# Altium schematic sheet Cell_121_sheet_1.SchDoc: Агат. Модуль дисплейного контроллера
size 420 x 297 mm; ApprovedBy: v0.4; CheckedBy: emuverse.ru; Author: Panther; CompanyName: agatcomp.ru; DocumentNumber: Фг3.089.121 Э3; Revision: v0.4; SheetNumber: 1; SheetTotal: 4; DocumentType: Схема электрическая принципиальная; Title2str: (Ячейка 121); Letter1Column: T
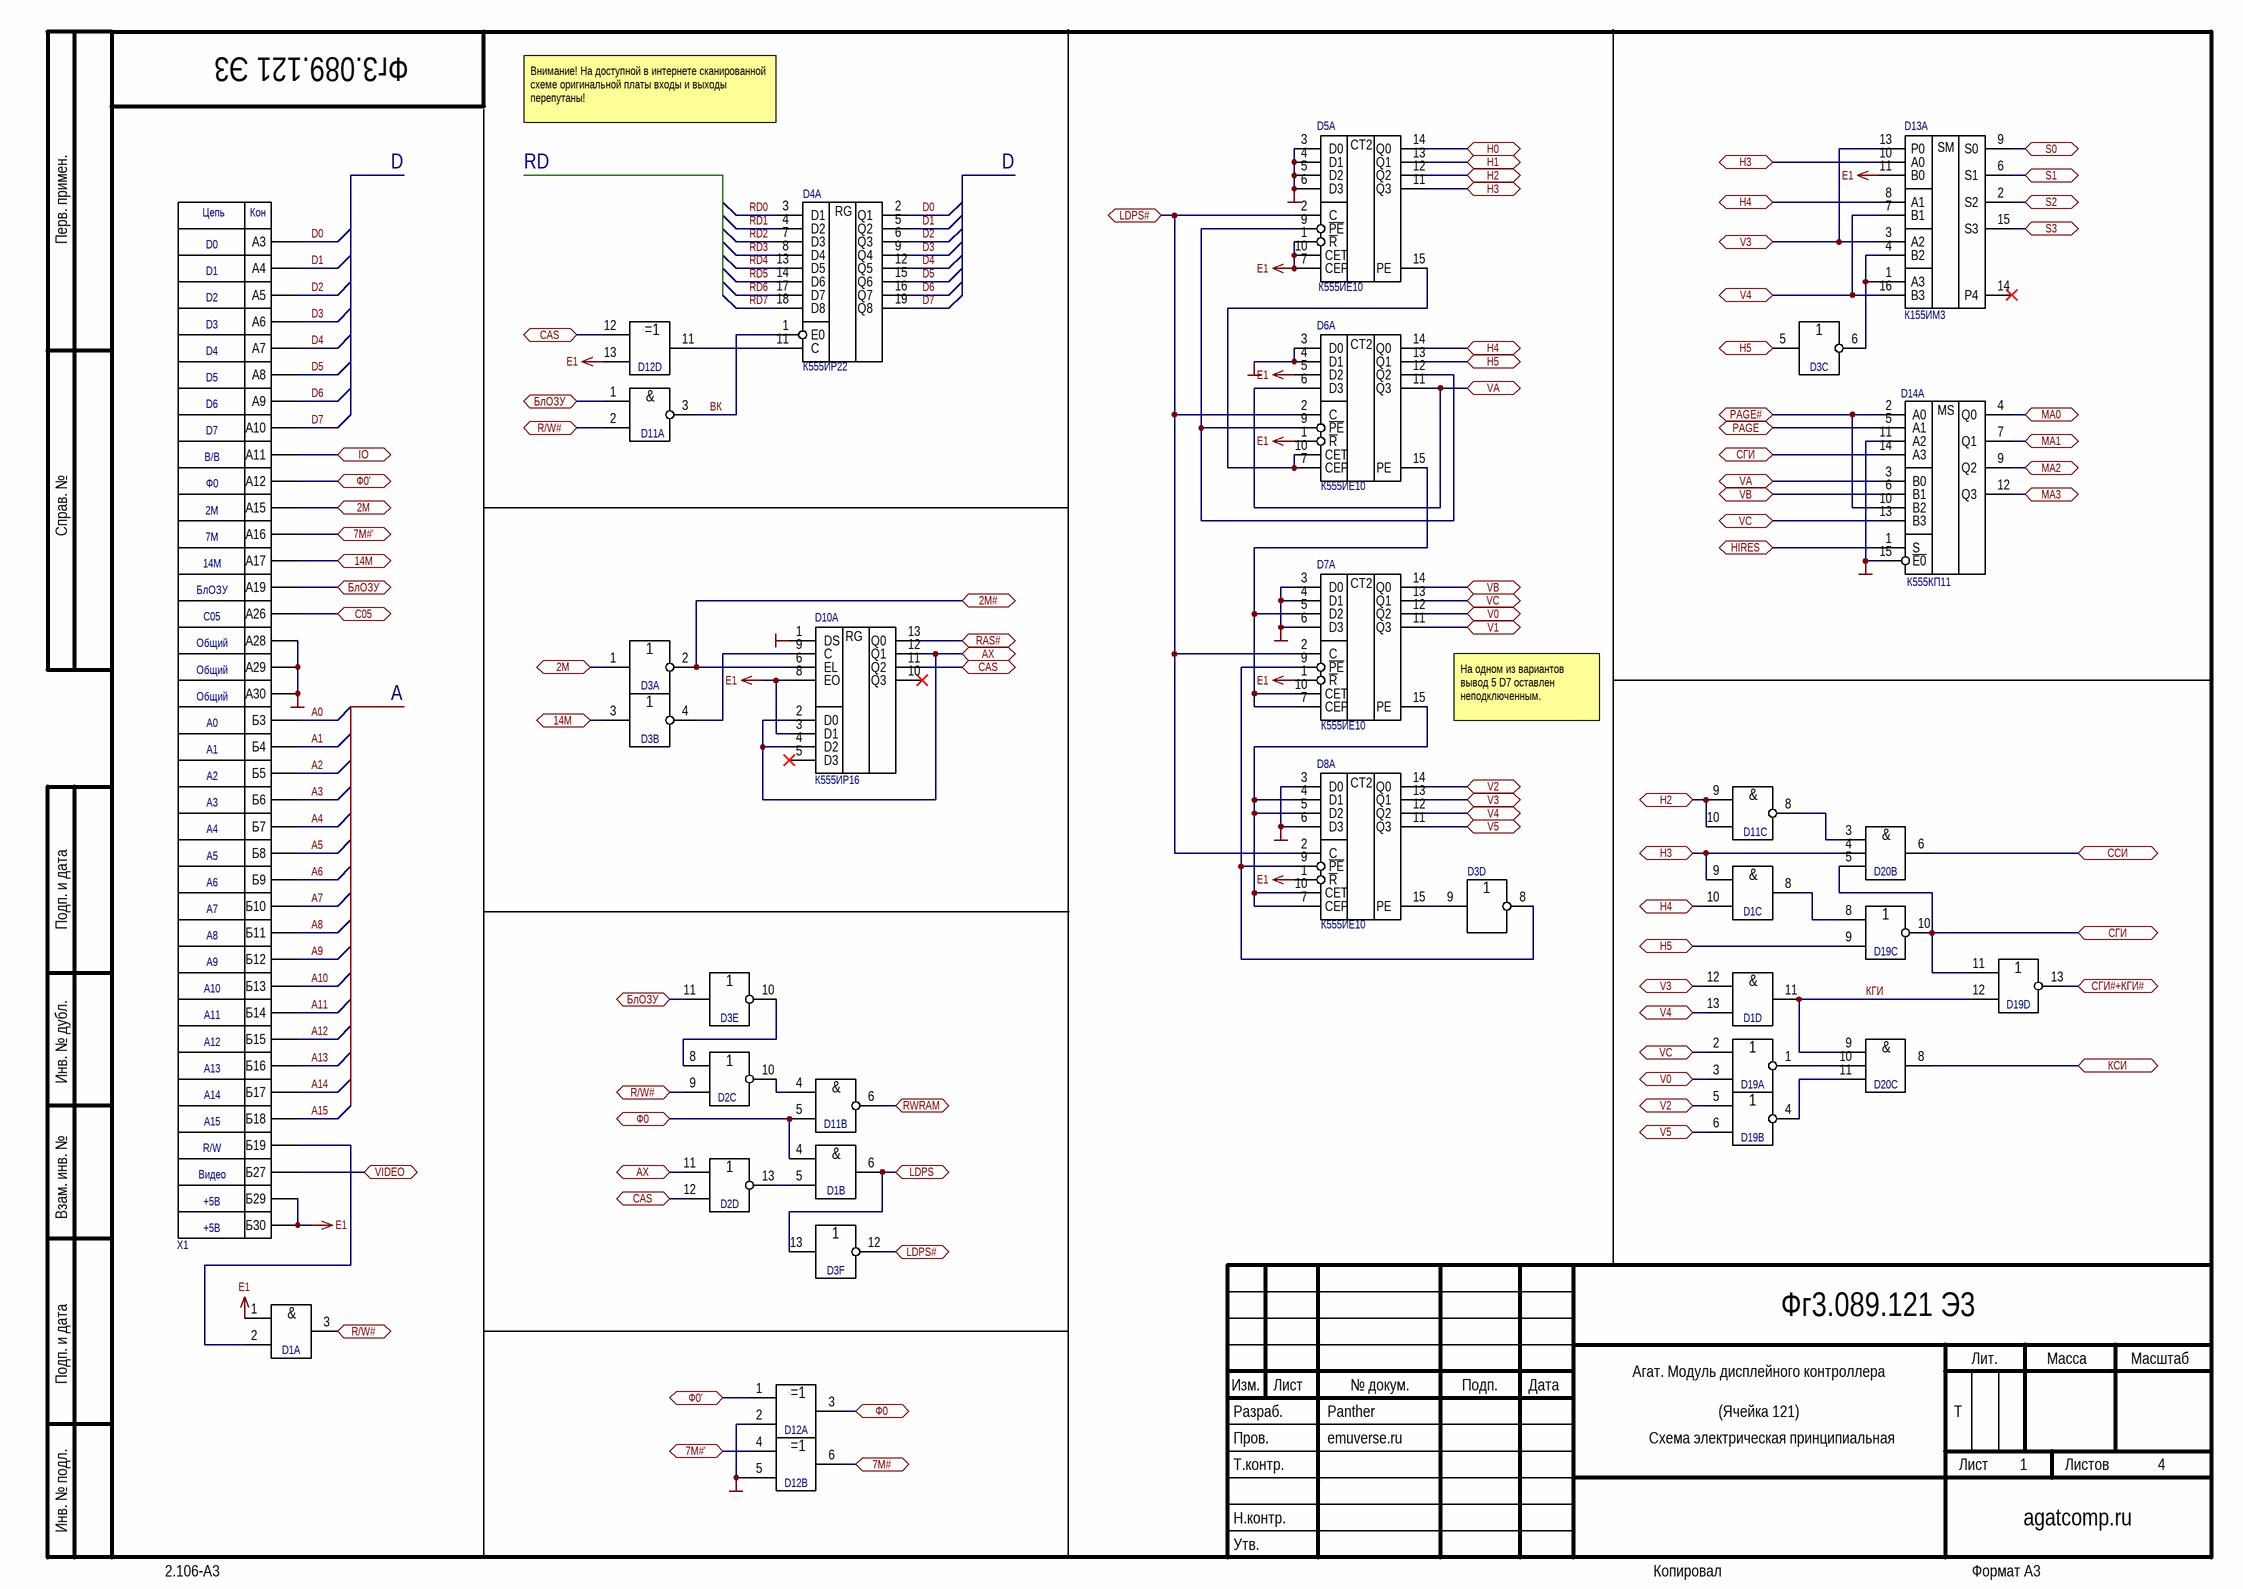
[diagram p0: Cell_121_sheet_1.SchDoc]

## Parts
D1  К555ЛИ1  [201.14]  (value not drawn)  (parts A,B,C,D of 5)
D2  К555ЛЕ1  [201.14]  (value not drawn)  (parts C,D of 5)
D3  К555ЛН1  [201.14]  (value not drawn)  (parts A,B,C,D,E,F of 7)
D4  К555ИР22  [201.20]  (part A of 2)
D5  К555ИЕ10  [201.16]  (part A of 2)
D6  К555ИЕ10  [201.16]  (part A of 2)
D7  К555ИЕ10  [201.16]  (part A of 2)
D8  К555ИЕ10  [201.16]  (part A of 2)
D10  К555ИР16  [201.14]  (part A of 2)
D11  К555ЛА3  [201.14]  (value not drawn)  (parts A,B,C of 5)
D12  К555ЛП5  [201.14]  (value not drawn)  (parts A,B,D of 5)
D13  К155ИМ3  [201.16]  (part A of 2)
D14  К555КП11  [201.16]  (part A of 2)
D19  К555ЛЕ1  [201.14]  (value not drawn)  (parts A,B,C,D of 5)
D20  К555ЛИ3  [201.14]  (value not drawn)  (parts B,C of 4)
X1  Agat-Ext  [AGAT_EXT]  (value not drawn)  (no BOM)

## Ports
2M (bidir, see Cell_121_sheet_1[1B]), 2M# (bidir, see Cell_121_sheet_3[2D]), 7M# (bidir, see Cell_121_sheet_3[1B], Cell_121_sheet_3[1C], Cell_121_sheet_3[2B], Cell_121_sheet_3[3B]), 7M#' (bidir, see Cell_121_sheet_1[1B]), 7M#' (bidir, see Cell_121_sheet_1[2D]), 14M (bidir, see Cell_121_sheet_1[1B]), AX (bidir, see Cell_121_sheet_1[2B], Cell_121_sheet_2[2C]), AX (bidir, see Cell_121_sheet_1[2C], Cell_121_sheet_2[2C]), C05 (bidir, see Cell_121_sheet_3[2D]), CAS (bidir, see Cell_121_sheet_1[1A], Cell_121_sheet_1[2B], Cell_121_sheet_2[3B], Cell_121_sheet_2[3C], Cell_121_sheet_2[3D]), CAS (bidir, see Cell_121_sheet_1[1A], Cell_121_sheet_1[2D], Cell_121_sheet_2[3B], Cell_121_sheet_2[3C], Cell_121_sheet_2[3D]), CAS (bidir, see Cell_121_sheet_1[2B], Cell_121_sheet_1[2D], Cell_121_sheet_2[3B], Cell_121_sheet_2[3C], Cell_121_sheet_2[3D]), H0 (bidir, see Cell_121_sheet_2[2B]), H1 (bidir, see Cell_121_sheet_2[2C]), H2 (bidir, see Cell_121_sheet_1[3A], Cell_121_sheet_2[2B]), H2 (bidir, see Cell_121_sheet_1[3C], Cell_121_sheet_2[2B]), H3 (bidir, see Cell_121_sheet_1[3A], Cell_121_sheet_1[3C]), H3 (bidir, see Cell_121_sheet_1[3A], Cell_121_sheet_1[4A]), H3 (bidir, see Cell_121_sheet_1[3C], Cell_121_sheet_1[4A]), H4 (bidir, see Cell_121_sheet_1[3A], Cell_121_sheet_1[3C]), H4 (bidir, see Cell_121_sheet_1[3A], Cell_121_sheet_1[4A]), H4 (bidir, see Cell_121_sheet_1[3C], Cell_121_sheet_1[4A]), H5 (bidir, see Cell_121_sheet_1[3A], Cell_121_sheet_1[3C]), H5 (bidir, see Cell_121_sheet_1[3A], Cell_121_sheet_1[4A]), H5 (bidir, see Cell_121_sheet_1[3C], Cell_121_sheet_1[4A]), HIRES (bidir, see Cell_121_sheet_3[4D]), IO (bidir, see Cell_121_sheet_2[1D]), LDPS (bidir, see Cell_121_sheet_3[1B], Cell_121_sheet_3[2B], Cell_121_sheet_3[3B]), LDPS# (bidir, see Cell_121_sheet_1[2A]), LDPS# (bidir, see Cell_121_sheet_1[2D]), MA0 (bidir, see Cell_121_sheet_2[2A]), MA1 (bidir, see Cell_121_sheet_2[2B]), MA2 (bidir, see Cell_121_sheet_2[2C]), MA3 (bidir, see Cell_121_sheet_2[2C]), PAGE (bidir, see Cell_121_sheet_3[4C]), PAGE# (bidir, see Cell_121_sheet_3[4C]), R/W# (bidir, see Cell_121_sheet_1[1B], Cell_121_sheet_1[1D], Cell_121_sheet_2[1D]), R/W# (bidir, see Cell_121_sheet_1[1B], Cell_121_sheet_1[2C], Cell_121_sheet_2[1D]), R/W# (bidir, see Cell_121_sheet_1[1D], Cell_121_sheet_1[2C], Cell_121_sheet_2[1D]), RAS# (bidir, see Cell_121_sheet_2[3B], Cell_121_sheet_2[3C], Cell_121_sheet_3[1A], Cell_121_sheet_3[1B]), RWRAM (bidir, see Cell_121_sheet_2[3B], Cell_121_sheet_2[3C], Cell_121_sheet_2[3D]), S0 (bidir, see Cell_121_sheet_2[2C]), S1 (bidir, see Cell_121_sheet_2[2A]), S2 (bidir, see Cell_121_sheet_2[2B]), S3 (bidir, see Cell_121_sheet_2[2C]), V0 (bidir, see Cell_121_sheet_1[3B], Cell_121_sheet_2[2A]), V0 (bidir, see Cell_121_sheet_1[3C], Cell_121_sheet_2[2A]), V1 (bidir, see Cell_121_sheet_2[2B]), V2 (bidir, see Cell_121_sheet_1[3B], Cell_121_sheet_2[2C], Cell_121_sheet_3[4C]), V2 (bidir, see Cell_121_sheet_1[3C], Cell_121_sheet_2[2C], Cell_121_sheet_3[4C]), V3 (bidir, see Cell_121_sheet_1[3C]), V3 (bidir, see Cell_121_sheet_1[3C], Cell_121_sheet_1[4A]), V4 (bidir, see Cell_121_sheet_1[3C], Cell_121_sheet_1[4A], Cell_121_sheet_3[4C]), V4 (bidir, see Cell_121_sheet_1[3C], Cell_121_sheet_3[4C]), V5 (bidir, see Cell_121_sheet_1[3C]), VA (bidir, see Cell_121_sheet_1[3A], Cell_121_sheet_3[2A]), VA (bidir, see Cell_121_sheet_1[4B], Cell_121_sheet_3[2A]), VB (bidir, see Cell_121_sheet_1[3B], Cell_121_sheet_3[2A]), VB (bidir, see Cell_121_sheet_1[4B], Cell_121_sheet_3[2A]), VC (bidir, see Cell_121_sheet_1[3B], Cell_121_sheet_1[3C], Cell_121_sheet_3[2A], Cell_121_sheet_3[3B]), VC (bidir, see Cell_121_sheet_1[3B], Cell_121_sheet_1[4B], Cell_121_sheet_3[2A], Cell_121_sheet_3[3B]), VC (bidir, see Cell_121_sheet_1[3C], Cell_121_sheet_1[4B], Cell_121_sheet_3[2A], Cell_121_sheet_3[3B]), VIDEO (bidir, see Cell_121_sheet_3[4A]), БлОЗУ (bidir, see Cell_121_sheet_1[1B], Cell_121_sheet_1[2C], Cell_121_sheet_2[1C]), БлОЗУ (bidir, see Cell_121_sheet_1[1B], Cell_121_sheet_2[1C]), КСИ (bidir, see Cell_121_sheet_3[4B], Cell_121_sheet_3[4C]), СГИ (bidir, see Cell_121_sheet_1[4B]), СГИ (bidir, see Cell_121_sheet_1[4C]), СГИ#+КГИ# (bidir, see Cell_121_sheet_3[1B]), ССИ (bidir, see Cell_121_sheet_3[4B]), Ф0 (bidir, see Cell_121_sheet_1[2C], Cell_121_sheet_2[2C]), Ф0 (bidir, see Cell_121_sheet_1[2D], Cell_121_sheet_2[2C]), Ф0' (bidir, see Cell_121_sheet_1[1B]), Ф0' (bidir, see Cell_121_sheet_1[2D])

## Nets
E1: D1.1(A) D5.1(~{R}) D5.7(CEP) D5.10(CET) D6.1(~{R}) D6.5(D2) D7.1(~{R}) D8.1(~{R}) D10.3(D1) D10.8(EO) D12.13(A) D13.11(B0) X1.B29(Б29) X1.B30(Б30)
GND: D5.3(D0) D5.4(D1) D5.5(D2) D5.6(D3) D6.3(D0) D6.4(D1) D7.3(D0) D7.4(D1) D7.6(D3) D8.3(D0) D8.6(D3) D10.1(DS) D12.2(B) D12.5(B) D14.11(A2) D14.15(~{E0}) X1.A28 X1.A29 X1.A30
2M: D3.1(A) X1.A15 ; port 2M
2M#: D3.2(~{O}) D10.6(EL) ; port 2M#
7M#: D12.6(O) ; port 7M#
7M#': D12.4(A) X1.A16 ; port 7M#'
14M: D3.3(A) X1.A17 ; port 14M
A0: X1.B3(Б3)
A1: X1.B4(Б4)
A2: X1.B5(Б5)
A3: X1.B6(Б6)
A4: X1.B7(Б7)
A5: X1.B8(Б8)
A6: X1.B9(Б9)
A7: X1.B10(Б10)
A8: X1.B11(Б11)
A9: X1.B12(Б12)
A10: X1.B13(Б13)
A11: X1.B14(Б14)
A12: X1.B15(Б15)
A13: X1.B16(Б16)
A14: X1.B17(Б17)
A15: X1.B18(Б18)
AX: D2.11(A) D10.2(D0) D10.4(D2) D10.12(Q1) ; port AX
C05: X1.A26 ; port C05
CAS: D2.12(B) D10.11(Q2) D12.12(B) ; port CAS
D0: D4.2(Q1) X1.A3
D1: D4.5(Q2) X1.A4
D2: D4.6(Q3) X1.A5
D3: D4.9(Q4) X1.A6
D4: D4.12(Q5) X1.A7
D5: D4.15(Q6) X1.A8
D6: D4.16(Q7) X1.A9
D7: D4.19(Q8) X1.A10
H0: D5.14(Q0) ; port H0
H1: D5.13(Q1) ; port H1
H2: D5.12(Q2) D11.9(A) D11.10(B) ; port H2
H3: D1.9(A) D5.11(Q3) D13.10(A0) D20.4(B) ; port H3
H4: D1.10(B) D6.14(Q0) D13.8(A1) ; port H4
H5: D3.5(A) D6.13(Q1) D19.9(B) ; port H5
HIRES: D14.1(S) ; port HIRES
IO: X1.A11 ; port IO
LDPS: D1.6(O) D3.13(A) ; port LDPS
LDPS#: D3.12(~{O}) D5.2(C) D6.2(C) D7.2(C) D8.2(C) ; port LDPS#
MA0: D14.4(Q0) ; port MA0
MA1: D14.7(Q1) ; port MA1
MA2: D14.9(Q2) ; port MA2
MA3: D14.12(Q3) ; port MA3
PAGE: D14.5(A1) ; port PAGE
PAGE#: D14.2(A0) D14.10(B2) ; port PAGE#
R/W#: D1.3(O) D2.9(B) D11.2(B) ; port R/W#
RAS#: D10.13(Q0) ; port RAS#
RD0: D4.3(D1)
RD1: D4.4(D2)
RD2: D4.7(D3)
RD3: D4.8(D4)
RD4: D4.13(D5)
RD5: D4.14(D6)
RD6: D4.17(D7)
RD7: D4.18(D8)
RWRAM: D11.6(~{O}) ; port RWRAM
S0: D13.9(S0) ; port S0
S1: D13.6(S1) ; port S1
S2: D13.2(S2) ; port S2
S3: D13.15(S3) ; port S3
V0: D7.12(Q2) D19.3(B) ; port V0
V1: D7.11(Q3) ; port V1
V2: D8.14(Q0) D19.5(A) ; port V2
V3: D1.12(A) D8.13(Q1) D13.3(A2) D13.13(P0) ; port V3
V4: D1.13(B) D8.12(Q2) D13.7(B1) D13.16(B3) ; port V4
V5: D8.11(Q3) D19.6(B) ; port V5
VA: D6.6(D3) D6.11(Q3) D14.3(B0) ; port VA
VB: D7.14(Q0) D14.6(B1) ; port VB
VC: D7.13(Q1) D14.13(B3) D19.2(A) ; port VC
VIDEO: X1.B27(Б27) ; port VIDEO
БлОЗУ: D3.11(A) D11.1(A) X1.A19 ; port БлОЗУ
ВК: D4.1(E0) D11.3(~{O})
КГИ: D1.11(O) D19.12(B) D20.9(A)
КСИ: D20.8(~{O}) ; port КСИ
СГИ: D14.14(A3) D19.10(~{O}) D19.11(A) D20.5(C) ; port СГИ
СГИ#+КГИ#: D19.13(~{O}) ; port СГИ#+КГИ#
ССИ: D20.6(~{O}) ; port ССИ
Ф0: D1.4(A) D11.5(B) D12.3(O) ; port Ф0
Ф0': D12.1(A) X1.A12 ; port Ф0'
NetD1_2: D1.2(B) X1.B19(Б19)
NetD1_5: D1.5(B) D2.13(~{O})
NetD1_8: D1.8(O) D19.8(A)
NetD2_8: D2.8(A) D3.10(~{O})
NetD2_10: D2.10(~{O}) D11.4(A)
NetD3_4: D3.4(~{O}) D10.9(C)
NetD3_6: D3.6(~{O}) D13.1(A3) D13.4(B2)
NetD3_8: D3.8(~{O}) D7.9(~{PE}) D8.9(~{PE})
NetD3_9: D3.9(A) D8.15(PE)
NetD4_11: D4.11(C) D12.11(O)
NetD5_9: D5.9(~{PE}) D6.9(~{PE}) D6.12(Q2)
NetD5_15: D5.15(PE) D6.7(CEP) D6.10(CET)
NetD6_15: D6.15(PE) D7.5(D2) D7.7(CEP) D7.10(CET)
NetD7_15: D7.15(PE) D8.4(D1) D8.5(D2) D8.7(CEP) D8.10(CET)
NetD11_8: D11.8(~{O}) D20.3(A)
NetD19_1: D19.1(~{O}) D20.10(B)
NetD19_4: D19.4(~{O}) D20.11(C)

Not connected (* = marked no-connect by the designer): D10 5(D3)* 10(Q3)*; D13 14(P4)*

## Notes on the sheet
- Внимание! На доступной в интернете сканированной схеме оригинальной платы входы и выходы перепутаны!
- D
- RD
- A
- (near D7) На одном из вариантов
  вывод 5 D7 оставлен
  неподключенным.
- Перв. примен.
- Справ. №
- Подп. и дата
- Инв. № дубл.
- Взам. инв. №
- Разраб.
- Изм.
- Лист
- № докум.
- Подп.
- Дата
- Лит.
- Масса
- Масштаб
- Пров.
- Т.контр.
- Листов
- Инв. № подл.
- Утв.
- Н.контр.
- 2.106-A3
- Копировал
- Формат А3
- (in symbol Agat-Ext) Цепь; Кон; D0; D1; D2; D3; D4; D5; D6; D7; В/В; Ф0; 2М; 7М; 14М; БлОЗУ; C05; Общий; A0; A1; A2; A13; A14; R/W; Видео; +5В
- (in symbol К155ИМ3, part A) SM
- (in symbol К555ИЕ10, part A) CT2
- (in symbol К555ИР16, part A) RG
- (in symbol К555ИР22, part A) RG
- (in symbol К555КП11, part A) MS
- (in symbol К555ЛА3, part A) &
- (in symbol К555ЛА3, part B) &
- (in symbol К555ЛА3, part C) &
- (in symbol К555ЛИ1, part A) &
- (in symbol К555ЛИ1, part B) &
- (in symbol К555ЛИ1, part C) &
- (in symbol К555ЛИ1, part D) &
- (in symbol К555ЛИ3, part B) &
- (in symbol К555ЛИ3, part C) &
- (in symbol К555ЛП5, part A) ·=1; ·
- (in symbol К555ЛП5, part B) ·=1; ·
- (in symbol К555ЛП5, part D) ·=1; ·

## Library data of the parts
D2 D19 = К555ЛЕ1: ManufacturerPartNumber: К555ЛА3
D3 = К555ЛН1: ManufacturerPartNumber: К155ЛН1
D5-D8 = К555ИЕ10: ManufacturerPartNumber: КР531ИЕ17
D10 = К555ИР16: ManufacturerPartNumber: КР531ИЕ17
D12 = К555ЛП5: ManufacturerPartNumber: К155ЛП5
D13 = К155ИМ3: ManufacturerPartNumber: SN74ALS138
D20 = К555ЛИ3: ManufacturerPartNumber: К555ЛА3
D1 = К555ЛИ1: ManufacturerPartNumber: К555ЛИ1
D11 = К555ЛА3: ManufacturerPartNumber: К555ЛА3
D14 = К555КП11: ManufacturerPartNumber: К555КП11